# EAGLE design schema_v1_4a (EAGLE 6.2)
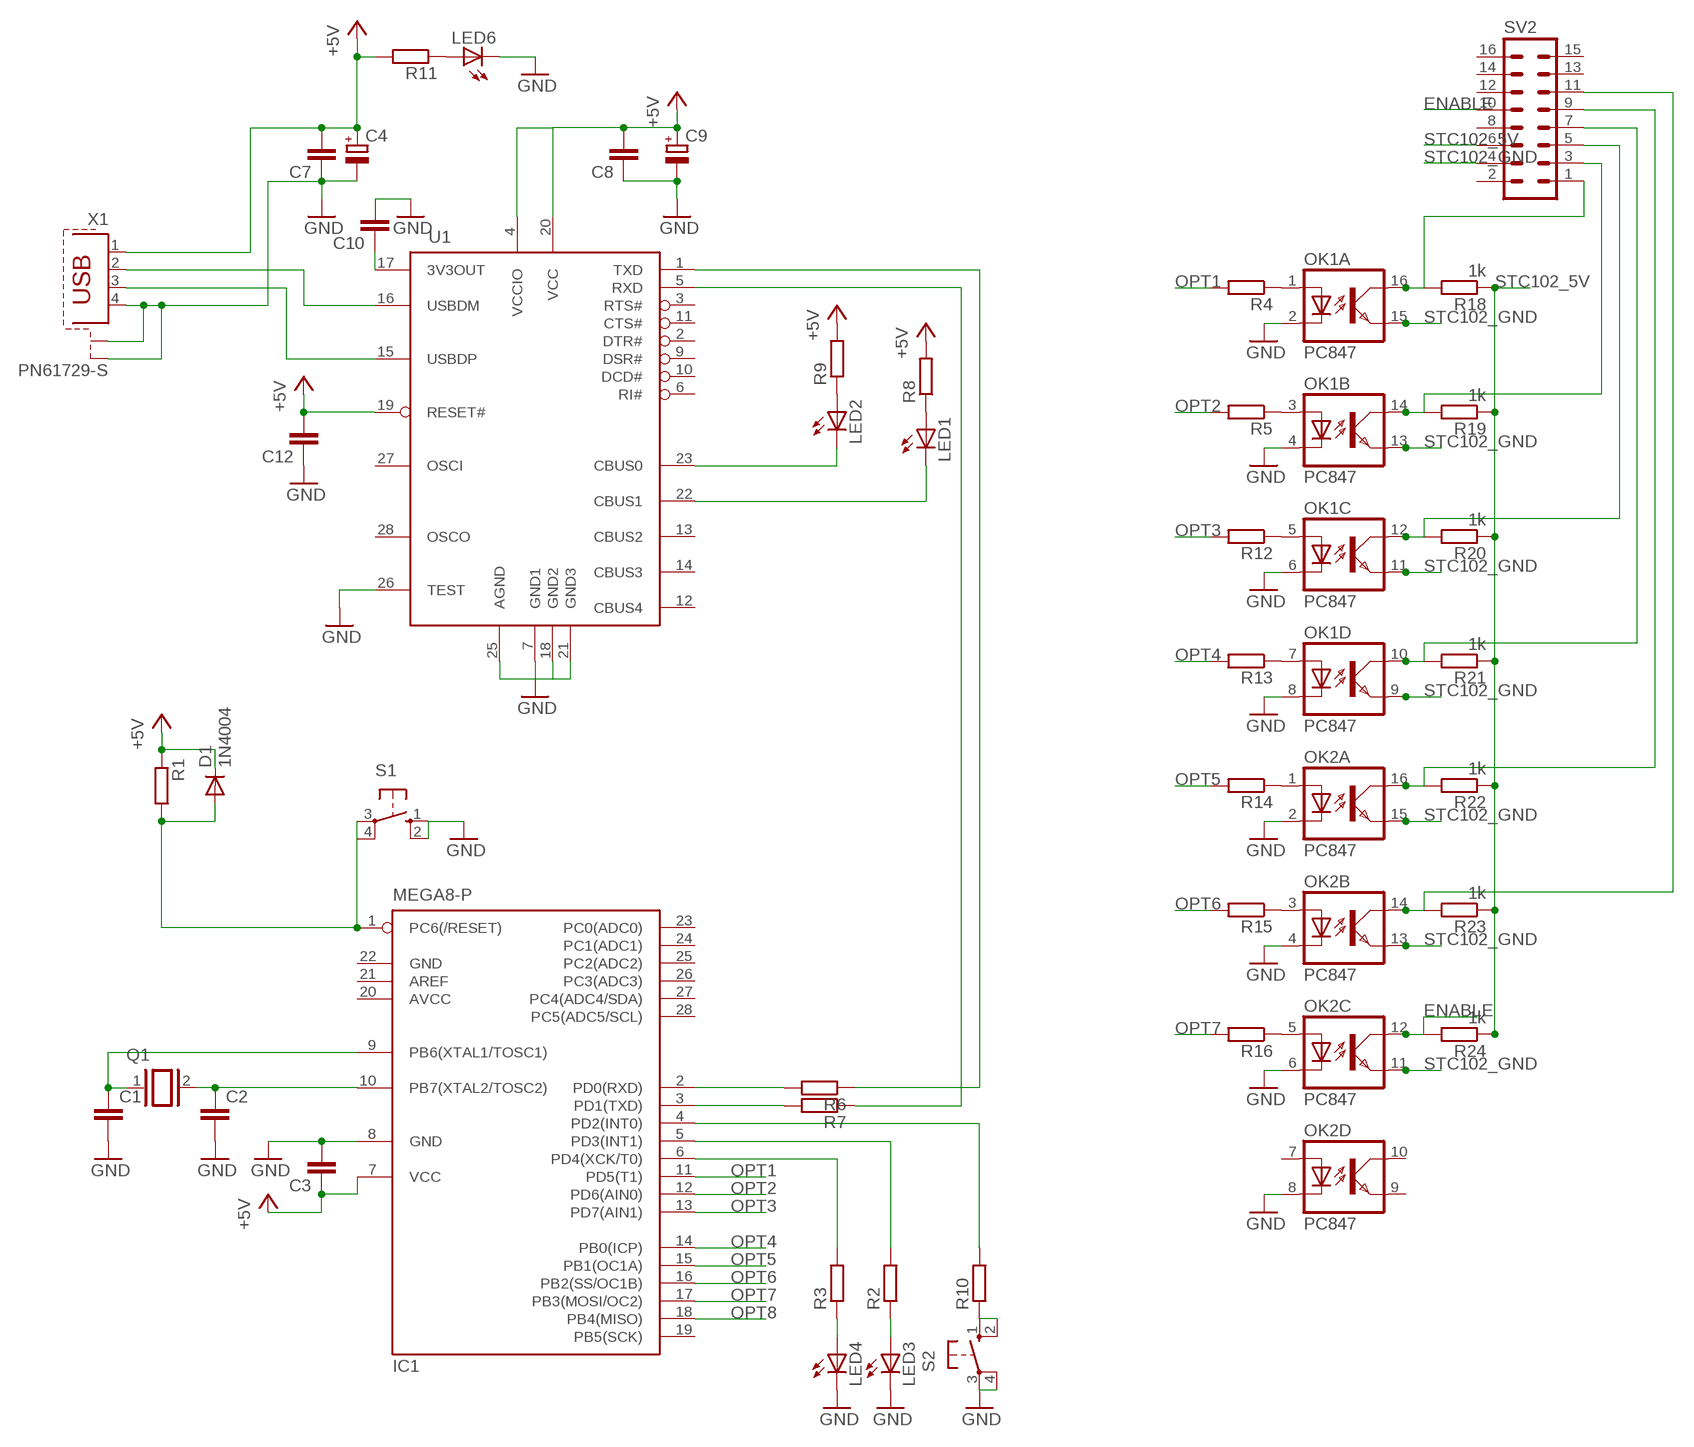
[diagram p0: schematic, sheet 1]

## Parts
C1  C-EUC0805  [C0805]
C2  C-EUC0805  [C0805]
C3  C-EUC0805  [C0805]
C4  CPOL-EUE2.5-5  [E2,5-5]
C7  C-EU025-025X050  [C025-025X050]
C8  C-EU025-025X050  [C025-025X050]
C9  CPOL-EUE2.5-5  [E2,5-5]
C10  C-EU025-025X050  [C025-025X050]
C12  C-EU025-025X050  [C025-025X050]
D1  1N4004  [DO41-10]
IC1  MEGA8-P  [DIL28-3]
LED1  LED3MM  [LED3MM]
LED2  LED3MM  [LED3MM]
LED3  LED3MM  [LED3MM]
LED4  LED3MM  [LED3MM]
LED6  LED3MM  [LED3MM]
OK1  PC847  [DIL16]
OK2  PC847  [DIL16]
Q1  XTAL  [Q]
R1  R-EU_M1206  [M1206]
R2  R-EU_0207/10  [0207/10]
R3  R-EU_0207/10  [0207/10]
R4  R-EU_0207/10  [0207/10]
R5  R-EU_0207/10  [0207/10]
R6  R-EU_M1206  [M1206]
R7  R-EU_M1206  [M1206]
R8  R-EU_M1206  [M1206]
R9  R-EU_M1206  [M1206]
R10  R-EU_0207/10  [0207/10]
R11  R-EU_M1206  [M1206]
R12  R-EU_0207/10  [0207/10]
R13  R-EU_0207/10  [0207/10]
R14  R-EU_0207/10  [0207/10]
R15  R-EU_0207/10  [0207/10]
R16  R-EU_0207/10  [0207/10]
R18  1k  R-EU_0207/10  [0207/10]
R19  1k  R-EU_0207/10  [0207/10]
R20  1k  R-EU_0207/10  [0207/10]
R21  1k  R-EU_0207/10  [0207/10]
R22  1k  R-EU_0207/10  [0207/10]
R23  1k  R-EU_0207/10  [0207/10]
R24  1k  R-EU_0207/10  [0207/10]
S1  10-XX  [B3F-10XX]
S2  10-XX  [B3F-10XX]
SV2  MA08-2  [MA08-2]
U1  FT232RL  [SSOP28DB]
X1  PN61729-S  [PN61729-S]

## Nets
+5V: C3.1 C4.+ C7.2 C8.2 C9.+ C12.2 D1.C IC1.7(VCC) R1.1 R8.2 R9.2 R11.2 U1.4(VCCIO) U1.19(RESET#) U1.20(VCC) X1.1
ENABLE: OK2.12(C:COL) R24.2 SV2.10
GND: C1.2 C2.2 C3.2 C4.- C7.1 C8.1 C9.- C10.2 C12.1 IC1.8(GND) LED3.K(C) LED4.K(C) LED6.K(C) OK1.2(A:C) OK1.4(B:C) OK1.6(C:C) OK1.8(D:C) OK2.2(A:C) OK2.4(B:C) OK2.6(C:C) OK2.8(D:C) S1.1(S) S1.2(S1) S2.3(P) S2.4(P1) U1.7(GND1) U1.18(GND2) U1.21(GND3) U1.25(AGND) U1.26(TEST) X1.4 X1.S1 X1.S2
N$1: C2.1 IC1.10(PB7(XTAL2/TOSC2)) Q1.2
N$2: C1.1 IC1.9(PB6(XTAL1/TOSC1)) Q1.1
N$3: D1.A IC1.1(PC6(/RESET)) R1.2 S1.3(P) S1.4(P1)
N$4: IC1.6(PD4(XCK/T0)) R3.2
N$5: IC1.4(PD2(INT0)) R10.2
N$6: LED3.A R2.1
N$7: LED4.A R3.1
N$8: R10.1 S2.1(S) S2.2(S1)
N$9: OK1.16(A:COL) R18.2 SV2.1
N$10: IC1.5(PD3(INT1)) R2.2
N$11: OK1.14(B:COL) R19.2 SV2.3
N$12: OK1.12(C:COL) R20.2 SV2.5
N$13: OK1.10(D:COL) R21.2 SV2.7
N$14: OK2.16(A:COL) R22.2 SV2.9
N$15: OK2.14(B:COL) R23.2 SV2.11
N$16: LED2.K(C) U1.23(CBUS0)
N$17: LED6.A R11.1
N$18: U1.16(USBDM) X1.2
N$19: U1.15(USBDP) X1.3
N$20: C10.1 U1.17(3V3OUT)
N$21: LED1.A R8.1
N$22: LED2.A R9.1
N$24: LED1.K(C) U1.22(CBUS1)
N$25: R6.1 U1.1(TXD)
N$26: IC1.2(PD0(RXD)) R6.2
N$27: IC1.3(PD1(TXD)) R7.2
N$28: R7.1 U1.5(RXD)
N$29: OK1.1(A:A) R4.1
N$30: OK1.3(B:A) R5.1
N$31: OK1.5(C:A) R12.1
N$32: OK1.7(D:A) R13.1
N$33: OK2.1(A:A) R14.1
N$34: OK2.3(B:A) R15.1
N$35: OK2.5(C:A) R16.1
OPT1: IC1.11(PD5(T1)) R4.2
OPT2: IC1.12(PD6(AIN0)) R5.2
OPT3: IC1.13(PD7(AIN1)) R12.2
OPT4: IC1.14(PB0(ICP)) R13.2
OPT5: IC1.15(PB1(OC1A)) R14.2
OPT6: IC1.16(PB2(SS/OC1B)) R15.2
OPT7: IC1.17(PB3(MOSI/OC2)) R16.2
OPT8: IC1.18(PB4(MISO))
STC102_5V: R18.1 R19.1 R20.1 R21.1 R22.1 R23.1 R24.1 SV2.6
STC102_GND: OK1.9(D:EMIT) OK1.11(C:EMIT) OK1.13(B:EMIT) OK1.15(A:EMIT) OK2.11(C:EMIT) OK2.13(B:EMIT) OK2.15(A:EMIT) SV2.4
Unconnected: IC1.19(PB5(SCK)) IC1.21(AREF) IC1.23(PC0(ADC0)) IC1.24(PC1(ADC1)) IC1.25(PC2(ADC2)) IC1.26(PC3(ADC3)) IC1.27(PC4(ADC4/SDA)) IC1.28(PC5(ADC5/SCL)) OK2.7(D:A) OK2.9(D:EMIT) OK2.10(D:COL) SV2.2 SV2.8 SV2.12 SV2.13 SV2.14 SV2.15 SV2.16 U1.2(DTR#) U1.3(RTS#) U1.6(RI#) U1.9(DSR#) U1.10(DCD#) U1.11(CTS#) U1.12(CBUS4) U1.13(CBUS2) U1.14(CBUS3) U1.27(OSCI) U1.28(OSCO)

## Power pins joined to a net without a drawn wire
AVCC: IC1.20(AVCC)
GND: IC1.22(GND)

## Library data of the parts
C1-C3 C7 C8 C10 C12 = rcl:C-EU: CAPACITOR, European symbol
C4 C9 = rcl:CPOL-EU: POLARIZED CAPACITOR, European symbol
D1 = diode:1N4004: DIODE general purpose rectifier, 1 A
IC1 = atmel:MEGA8-P: MICROCONTROLLER 8 Kbytes FLASH, 1 kbytes SRAM, 512 bytes EEPROM, USART, 4-channel 10 bit ADC, 2-channel 8 bit ADC Pin compatible with Atmega48, ATMega88, ATMega168 Source: avr.lbr; OC_FARNELL: unknown; OC_NEWARK: unknown
LED1-LED4 LED6 = led:LED: LED OSRAM: - CHIPLED LG R971, LG N971, LY N971, LG Q971, LY Q971, LO R971, LY R971 LH N974, LH R974 LS Q976, LO Q976, LY Q976 LO Q996 - Hyper CHIPLED LW Q18S LB Q993, LB Q99A, LB R99A - SideLED LS A670, LO A670, LY A670, LG A670, LP A670 LB A673, LV A673, LT A673, LW A673 LH A674 LY A675 LS A676, LA A676, LO A676, LY A676, LW A676 LS A679, LY A679, LG A679 - Hyper Micro SIDELED® LS Y876, LA Y876, LO Y876, LY Y876 LT Y87S - SmartLED LW L88C, LW L88S LB L89C, LB L89S, LG L890 LS L89K, LO L89K, LY L89K LS L896, LA L896, LO L896, LY L896 - TOPLED LS T670, LO T670, LY T670, LG T670, LP T670 LSG T670, LSP T670, LSY T670, LOP T670, LYG T670 LG T671, LOG T671, LSG T671 LB T673, LV T673, LT T673, LW T673 LH T674 LS T676, LA T676, LO T676, LY T676, LB T676, LH T676, LSB T676, LW T676 LB T67C, LV T67C, LT T67C, LS T67K, LO T67K, LY T67K, LW E67C LS E67B, LA E67B, LO E67B, LY E67B, LB E67C, LV E67C, LT E67C LW T67C LS T679, LY T679, LG T679 LS T770, LO T770, LY T770, LG T770, LP T770 LB T773, LV T773, LT T773, LW T773 LH T774 LS E675, LA E675, LY E675, LS T675 LS T776, LA T776, LO T776, LY T776, LB T776 LHGB T686 LT T68C, LB T68C - Hyper Mini TOPLED® LB M676 - Mini TOPLED Santana® LG M470 LS M47K, LO M47K, LY M47K Source: http://www.osram.convergy.de LUXEON: - LUMILED® LXK2-PW12-R00, LXK2-PW12-S00, LXK2-PW14-U00, LXK2-PW14-V00 LXK2-PM12-R00, LXK2-PM12-S00, LXK2-PM14-U00 LXK2-PE12-Q00, LXK2-PE12-R00, LXK2-PE12-S00, LXK2-PE14-T00, LXK2-PE14-U00 LXK2-PB12-K00, LXK2-PB12-L00, LXK2-PB12-M00, LXK2-PB14-N00, LXK2-PB14-P00, LXK2-PB14-Q00 LXK2-PR12-L00, LXK2-PR12-M00, LXK2-PR14-Q00, LXK2-PR14-R00 LXK2-PD12-Q00, LXK2-PD12-R00, LXK2-PD12-S00 LXK2-PH12-R00, LXK2-PH12-S00 LXK2-PL12-P00, LXK2-PL12-Q00, LXK2-PL12-R00 Source: www.luxeon.com KINGBRIGHT: KA-3528ASYC Source: www.kingbright.com
OK1 OK2 = optocoupler:PC847: SHARP OPTO COUPLER; OC_FARNELL: 9707735; OC_NEWARK: unknown
Q1 = special:XTAL: CRYSTAL
R1-R16 R18-R24 = rcl:R-EU_: RESISTOR, European symbol
S1 S2 = switch-omron:10-XX: OMRON SWITCH; MPN: B3F-1000; OC_FARNELL: 176432; OC_NEWARK: 36M3542
SV2 = con-lstb:MA08-2: PIN HEADER; OC_FARNELL: unknown; OC_NEWARK: unknown
U1 = ftdichip-5:FT232RL: USB UART 4th Generation USB UART (USB <-> Serial) Controller
X1 = con-berg:PN61729-S: BERG USB connector; OC_FARNELL: unknown; OC_NEWARK: unknown

## Board
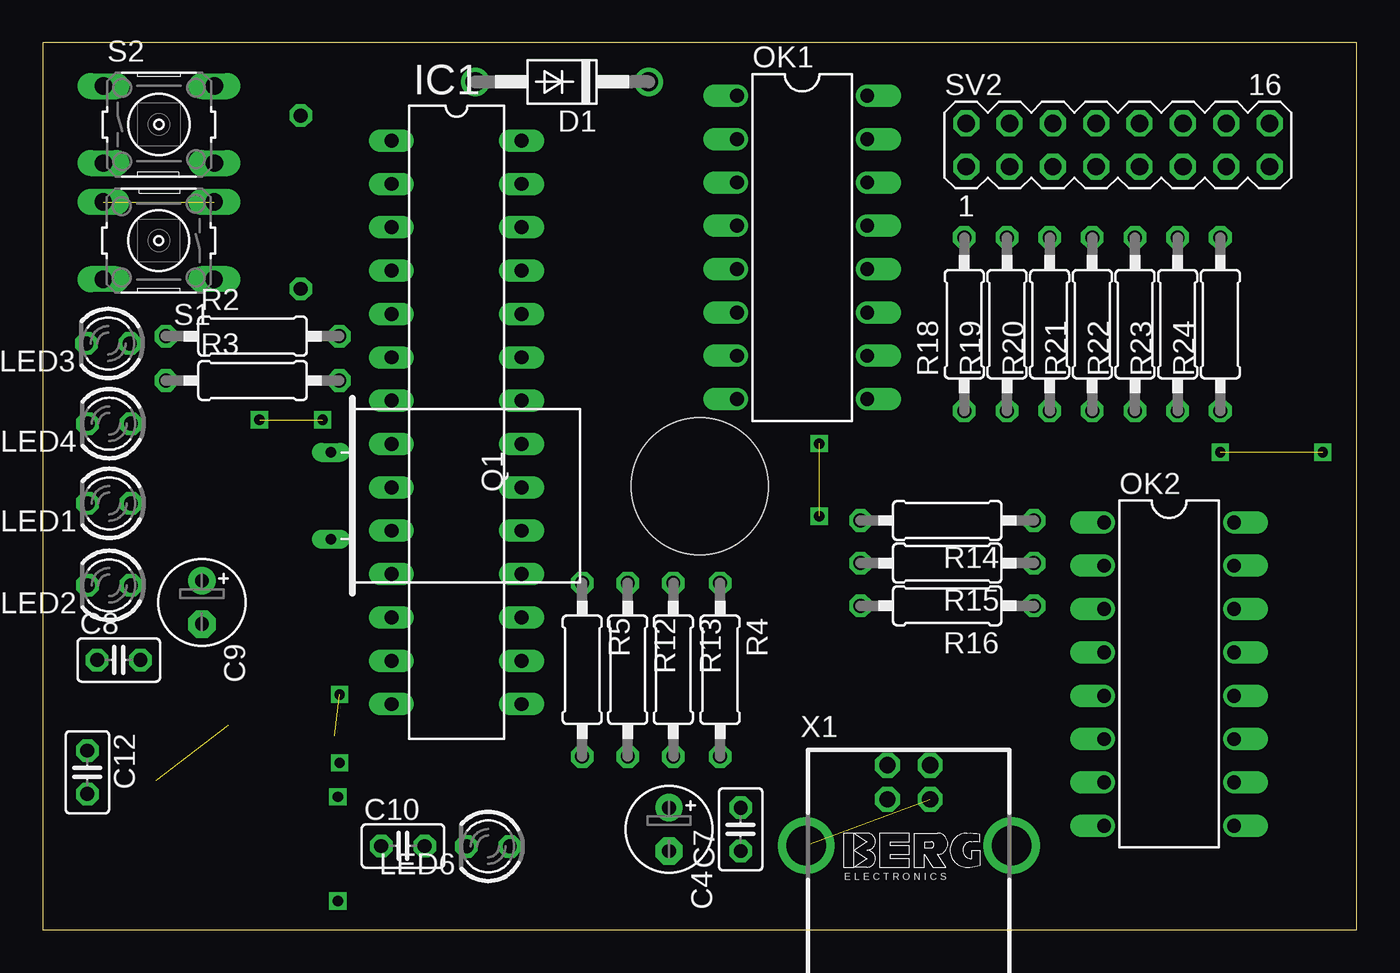
[diagram p1: board, top side]
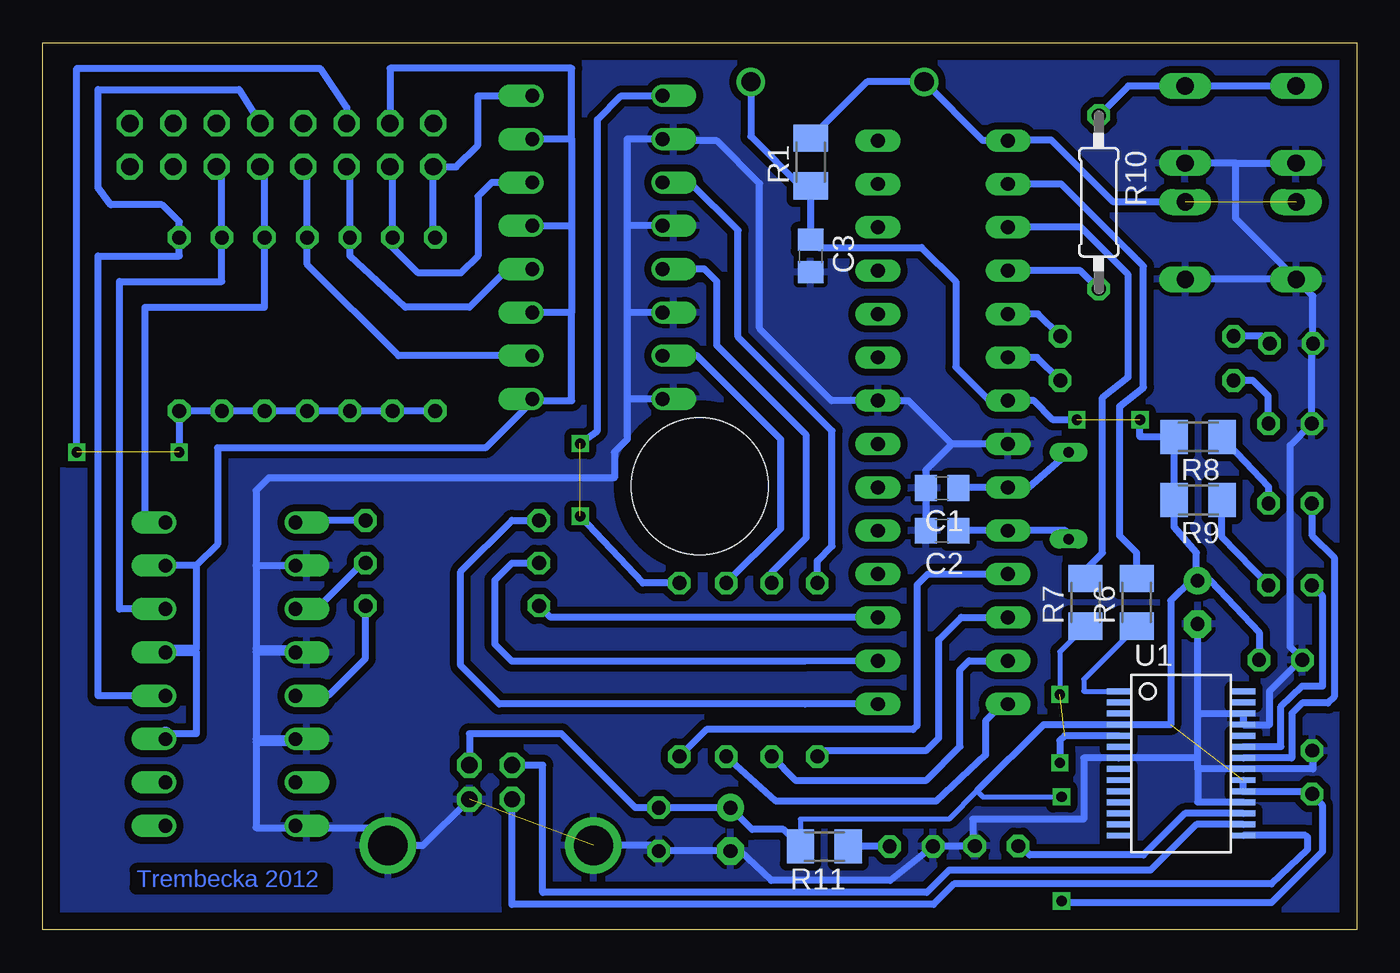
[diagram p2: board, bottom side, seen from below]

Size 77 x 52 mm. Coordinates in mm from the lower left corner, seen from the top.
Outline: 0,0 77,0 77,52 0,52 0,0
Copper layers (1*16): Top 0.035mm / dielectric 1.5mm / Bottom 0.035mm
Design rules: minimum track width 10mil, minimum drill 24mil, track to track 8mil, track to pad 8mil, pad to pad 8mil, via to via 8mil, smd to smd 8mil, copper to edge 40mil, drill to drill 8mil, minimum pad ring 10mil, minimum via ring 8mil, stop-mask expansion 4mil, vias tented up to drill 0mil, thermal gap 10mil
Holes 8 mm at 38.5,26

### Footprints (pad centres in the part's own frame; a part is rotated, then mirrored left to right if it is on the bottom)
C0805 = smd 1.3 x 1.5: 1 -0.95,0; 2 0.95,0
E2,5-5 = drill 0.813 pad 1.6: + -1.27,0 | drill 0.813 pad 1.6 octagon: - 1.27,0
C025-025X050 = drill 0.813 octagon: 1 -1.27,0; 2 1.27,0
DO41-10 = drill 1.118: A 5.08,0; C -5.08,0
DIL28-3 = drill 0.813 long: 1 -16.51,-3.81; 2 -13.97,-3.81; 3 -11.43,-3.81; 4 -8.89,-3.81; 5 -6.35,-3.81; 6 -3.81,-3.81; 7 -1.27,-3.81; 8 1.27,-3.81; 9 3.81,-3.81; 10 6.35,-3.81; 11 8.89,-3.81; 12 11.43,-3.81; 13 13.97,-3.81; 14 16.51,-3.81; 15 16.51,3.81; 16 13.97,3.81; 17 11.43,3.81; 18 8.89,3.81; 19 6.35,3.81; 20 3.81,3.81; 21 1.27,3.81; 22 -1.27,3.81; 23 -3.81,3.81; 24 -6.35,3.81; 25 -8.89,3.81; 26 -11.43,3.81; 27 -13.97,3.81; 28 -16.51,3.81
LED3MM = drill 0.813 octagon: A -1.27,0; K 1.27,0
DIL16 = drill 0.813 offset: 1 -8.89,-3.81; 2 -6.35,-3.81; 3 -3.81,-3.81; 4 -1.27,-3.81; 5 1.27,-3.81; 6 3.81,-3.81; 7 6.35,-3.81; 8 8.89,-3.81; 9 8.89,3.81; 10 6.35,3.81; 11 3.81,3.81; 12 1.27,3.81; 13 -1.27,3.81; 14 -3.81,3.81; 15 -6.35,3.81; 16 -8.89,3.81
Q = drill 0.61 long: 1 -2.54,-7.62; 2 2.54,-7.62
M1206 = smd 1.6 x 2: 1 -1.4,0; 2 1.4,0
0207/10 = drill 0.813 octagon: 1 -5.08,0; 2 5.08,0
B3F-10XX = drill 1.016 long: 1 -3.251,2.261; 2 3.251,2.261; 3 -3.251,-2.261; 4 3.251,-2.261
MA08-2 = drill 1.016 octagon: 1 -8.89,-1.27; 2 -8.89,1.27; 3 -6.35,-1.27; 4 -6.35,1.27; 5 -3.81,-1.27; 6 -3.81,1.27; 7 -1.27,-1.27; 8 -1.27,1.27; 9 1.27,-1.27; 10 1.27,1.27; 11 3.81,-1.27; 12 3.81,1.27; 13 6.35,-1.27; 14 6.35,1.27; 15 8.89,-1.27; 16 8.89,1.27
SSOP28DB = smd 0.348 x 1.397: 1 -4.225,-3.656; 2 -3.575,-3.656; 3 -2.925,-3.656; 4 -2.275,-3.656; 5 -1.625,-3.656; 6 -0.975,-3.656; 7 -0.325,-3.656; 8 0.325,-3.656; 9 0.975,-3.656; 10 1.625,-3.656; 11 2.275,-3.656; 12 2.925,-3.656; 13 3.575,-3.656; 14 4.225,-3.656; 15 4.225,3.656; 16 3.575,3.656; 17 2.925,3.656; 18 2.275,3.656; 19 1.625,3.656; 20 0.975,3.656; 21 0.325,3.656; 22 -0.325,3.656; 23 -0.975,3.656; 24 -1.625,3.656; 25 -2.275,3.656; 26 -2.925,3.656; 27 -3.575,3.656; 28 -4.225,3.656
PN61729-S = drill 0.95 octagon: 1 1.25,4.71; 2 -1.25,4.71; 3 -1.25,2.71; 4 1.25,2.71 | drill 2.3 pad 2.9: S1 -6.02,0; S2 6.02,0

### Placement (x,y rotation side)
C1  24.3,25.9 180 bottom
C2  24.3,23.4 180 bottom
C3  32,39.5 270 bottom
C4  36.7,5.9 270 top
C7  40.9,5.9 90 top
C8  4.46,15.82 0 top
C9  9.33,19.2 270 top
C10  21.11,4.92 0 top
C12  2.62,9.24 270 top
D1  30.43,49.7 180 top
IC1  24.25,29.75 270 top
LED1  3.9,25 180 top
LED2  3.9,20.2 180 top
LED3  3.84,34.37 180 top
LED4  3.9,29.67 180 top
LED6  26.1,4.9 180 top
OK1  44.5,40 270 top
OK2  66,15 270 top
Q1  24.5,25.45 270 top
R1  32,45 90 bottom
R2  12.3,34.8 0 top
R3  12.3,32.2 0 top
R4  39.69,15.25 270 top
R5  31.61,15.25 270 top
R6  12.9,19.2 90 bottom
R7  15.9,19.2 90 bottom
R8  9.3,28.9 180 bottom
R9  9.3,25.2 180 bottom
R10  15.12,42.65 270 bottom
R11  31.2,4.9 180 bottom
R12  34.28,15.25 270 top
R13  36.95,15.25 270 top
R14  53,24 180 top
R15  53,21.5 180 top
R16  53,19 180 top
R18  54,35.5 90 top
R19  56.5,35.5 90 top
R20  59,35.5 90 top
R21  61.5,35.5 90 top
R22  64,35.5 90 top
R23  66.5,35.5 90 top
R24  69,35.5 90 top
S1  6.8,40.4 180 top
S2  6.82,47.2 0 top
SV2  63,46 0 top
U1  10.3,9.76 270 bottom
X1  50.75,4.95 0 top

### Tracks (layer width: path | path; a pad name or v marks a point on that pad's centre or on a via)
+5V  (via drill 0.6)  (2 unrouted)
  Bottom 0.305: R11.2 32.6,6.5 23.9,6.5 22.25,8.15 21.9,7.8 17.3,7.8 | U1.20 U1.19 2.79,8.13 C12.2 | 6.7,8.1 6.64,8.16
  Bottom 0.406: R11.2 33.6,5.9 35.43,5.9 C4.+ C7.2 42.27,7.17 46.6,11.5 52,11.5 X1.1 | 22.25,8.15 18.36,12.04 U1.4 10.9,12.04 10.9,19.3 9.73,20.47 C9.+ 8.57,20.47 5.7,17.4 5.7,15.85 | 9.4,20.54 9.4,22.1 10.7,23.6 R9.2 R8.2 12.7,28.9 v12.7,29.9 | v16.4,29.9 17.8,29.9 18.92,31.02 IC1.7 21.52,31.02 23.5,33 23.5,38 25.5,40 31.55,40 C3.1 R1.1 32.1,43.5 32.5,43.5 35.51,46.51 D1.C | 6.64,8.16 U1.20 | 6.7,8.1 2.8,8.1 2,7.3 2,4.6 5,1.6 17.2,1.6
  Bottom 0.813: C9.+ 9.4,20.54 | C8.2 5.7,15.85
ENABLE
  Bottom 0.406: SV2.10 65.5,49.25 73.75,49.25 73.75,43.5 73,42.5 70,42.5 69,41.5 R24.2 69,39.5 73.75,39.5 73.75,13.73 OK2.12
GND  (1 unrouted)
  Bottom 0.305: 6.64,7.5 U1.18 | 3.28,15.82 C8.1 3.19,15.89 | 9.33,10 9.41,10.09
  Bottom 0.406: 64.5,21.35 OK2.2 | 64.5,21.35 64.5,16.5 62.19,16.5 | OK2.4 64.5,16.27 64.5,11 62.19,11 | OK2.6 64.5,11.19 64.5,6 62.19,6 57.82,6 X1.S2 54.71,4.95 X1.4 | OK1.2 42.75,46.35 42.75,41.27 | 42.75,36.19 42.75,31.11 | 42.75,31.11 42.75,28.75 43.5,28 43.5,26.5 63.75,26.5 64.5,25.75 64.5,21.35 | 40.59,46.25 37.5,46.25 35,43.75 35,35.25 30.77,31.02 IC1.22 26.26,31.02 23.72,28.48 | S1.2 S1.1 | 7.1,44.94 S2.3 | 2.63,34.31 LED4.K 3.9,28.4 3.9,16.6 3.19,15.89 | X1.S1 41.22,4.95 C7.1 C4.- 36.13,4.63 34.3,2.9 27.33,2.9 LED6.K 22.64,4.9 22.5,5.04 | C12.1 2.58,9.44 U1.21 9.33,9.44 | 9.33,12.69 U1.26 U1.25 5.1,12.04 5.1,14 3.28,15.82 | 9.33,12.69 C9.- | 9.33,9.44 9.33,10 9.33,12.69 | 9.41,10.09 U1.7 16,10.09 16,6.5 22.5,6.5 22.5,5.04 | 6.64,7.5 9.33,7.5 9.33,9.44 | IC1.8 23.72,28.48 | C2.2 C1.2 25.25,26.95 23.72,28.48 | LED3.K 2.57,37.16 S1.2 | S1.2 7.1,41.69 7.1,44.94 | 7.1,44.94 S2.4 | 22.5,5.04 C10.2 | OK1.6 42.75,36.19 | OK1.4 42.75,41.27 | 42.75,41.27 42.75,36.19 | OK1.8 42.75,31.11
  Bottom 0.61: 40.59,46.25 OK1.2
  Bottom 0.813: 62.19,16.5 OK2.4 | 62.19,11 OK2.6 | 62.19,6 OK2.8 | 2.63,34.31 LED3.K
  pour Bottom (isolate 0.406): 0,52 77,52 77,0 0,0
N$1
  Bottom 0.406: Q1.2 17.07,23.4 IC1.10 C2.1
N$2
  Bottom 0.406: Q1.1 19.23,25.94 IC1.9 23.31,25.94
  Bottom 0.813: 23.31,25.94 arc-90 C1.1
N$3  (1 unrouted)
  Bottom 0.406: IC1.1 21.91,46.26 D1.A 28.7,49.7 R1.2 | S1.3 14.26,42.66 17.9,46.3 20.4,46.3
  Bottom 1.016: 20.4,46.3 IC1.1
N$4
  Bottom 0.406: IC1.6 18.74,33.56 R3.2
N$5
  Bottom 0.406: R10.2 16.19,38.64 IC1.4
N$6
  Bottom 0.406: R2.1 5.54,34.8 LED3.A
N$7
  Bottom 0.406: R3.1 6.1,32.2 5.2,31.3 5.2,29.7
  Bottom 0.813: LED4.A 5.2,29.7
N$8
  Bottom 0.406: S2.1 S2.2 13.39,49.46 R10.1
N$9
  Bottom 0.406: R18.2 54.11,40.58 SV2.1 | SV2.1 53.84,45 | OK1.16 51.5,48.89 51.5,46 52.77,44.73 SV2.1
N$10
  Bottom 0.406: IC1.5 18.68,36.1 R2.2
N$11
  Bottom 0.406: SV2.3 56.5,44.58 R19.2 56.5,40 55,38.5 52.5,38.5 51.5,39.5 51.5,43 50.69,43.81 OK1.14
N$12
  Bottom 0.406: SV2.5 59,44.54 R20.2 59,39.5 55.75,36.5 52,36.5 49.77,38.73 OK1.12
N$13
  Bottom 0.406: SV2.7 61.5,44.5 R21.2 61.5,39 56.15,33.65 OK1.10
N$14
  Bottom 0.406: SV2.9 64,44.46 R22.2 64,36.5 71,36.5 71,23.89
  Bottom 0.813: OK2.16 71,23.89
N$15
  Bottom 0.406: SV2.11 66.5,44.42 R23.2 66.5,38 72.5,38 72.5,18.81 OK2.14
N$16
  Bottom 0.406: U1.23 4.45,10.73 4.45,13.1 3.2,14.3 2,14.3 2,19.57 LED2.K
N$17
  Bottom 0.406: LED6.A R11.1
N$18
  Bottom 0.406: X1.2 47.7,9.66 47.7,2.2 25.2,2.2 23.9,3.5 12.09,3.5 9.4,6.18 U1.16
N$19
  Bottom 0.305: 2.9,5.54 3,5.54 2.9,5.43
  Bottom 0.406: X1.3 49.5,1.5 24.8,1.5 23.6,2.7 5,2.7 2.9,4.7 2.9,5.43 | 3,5.54 U1.15
N$20
  Bottom 0.406: C10.1 19.16,4.4 12.5,4.4 10.06,6.83 U1.17
N$21
  Bottom 0.406: R8.1 5.17,25.97 LED1.A
N$22
  Bottom 0.406: R9.1 7.9,23.03 LED2.A
N$23  (via drill 0.6)
  other vias: 17.3,1.7
N$24
  Bottom 0.305: 3.8,10.1 3.81,10.09 | 2.6,24.97 LED1.K
  Bottom 0.406: 3.81,10.09 U1.22 | 3.8,10.1 3.8,12.7 3.2,13.3 1.7,13.3 1.3,13.7 1.3,21.8 2.6,23.1 2.6,24.97
N$25
  Bottom 0.305: R6.1 16,14.7 16,13.98 U1.1
N$26
  Bottom 0.406: IC1.2 17.32,43.72 12.5,38.9 12.5,31.8 13.9,30.7 13.9,23.1 12.9,22.1 R6.2
N$27
  Bottom 0.406: IC1.3 16.18,41.18 13.4,38.4 13.4,32.4 14.9,31.2 14.9,22.1 15.9,21.1 R7.2
N$28  (via drill 0.6)  (1 unrouted)
  Bottom 0.305: R7.1 17.4,16.3 v17.4,13.8
  Bottom 0.406: U1.5 17.11,11.38 17.4,11.1 v17.4,9.8
N$29  (via drill 0.6)  (1 unrouted)
  Bottom 0.406: R4.1 41.83,20.33 v45.5,24.25 | v45.5,28.5 44.5,29.25 44.5,47.5 43.11,48.89 OK1.1
N$30
  Bottom 0.406: R5.1 31.61,21.64 30.75,22.5 30.75,29.25 36.25,34.75 36.25,41 39.06,43.81
  Bottom 0.61: 39.06,43.81 OK1.3
N$31
  Bottom 0.406: R12.1 34.28,20.97 32.25,23 32.25,29 37.5,34.25 37.5,38 38.23,38.73 OK1.5
N$32
  Bottom 0.406: OK1.7 38.65,33.65 33.75,28.75 33.75,23.53 R13.1
N$33
  Bottom 0.406: R14.1 62.08,24
  Bottom 0.813: 62.08,24 OK2.1
N$34
  Bottom 0.406: 58.25,21.5 61,18.75 62.13,18.75
  Bottom 0.813: 58.25,21.5 R15.1 | 62.13,18.75 OK2.3
N$35
  Bottom 0.406: R16.1 58.08,15.92 60.25,13.75 62.17,13.75
  Bottom 0.813: 62.17,13.75 OK2.5
N$36  (via drill 0.6)
  other vias: 17.3,7.8
OPT1
  Bottom 0.406: R4.2 38.11,11.75 26,11.75 25.75,12 25.75,20.25 25.14,20.86 IC1.11
OPT2
  Bottom 0.406: R5.2 31.28,10.5 25.25,10.5 24.5,11.25 24.5,17 23.18,18.32 IC1.12
OPT3
  Bottom 0.406: R12.2 32.86,8.75 25.25,8.75 23.25,10.75 23.25,15.25 22.72,15.78 IC1.13
OPT4
  Bottom 0.406: R13.2 34.03,7.55 24.65,7.55 21.75,10.25 21.75,12.25 20.76,13.24 IC1.14
OPT5
  Bottom 0.406: R14.2 49.5,24 52.5,21 52.5,15.5 50.25,13.25 32.32,13.25 IC1.15
OPT6
  Bottom 0.406: R15.2 49.5,21.5 50.5,20.5 50.5,16.75 49.5,15.75 32.34,15.75 IC1.16
OPT7
  Bottom 0.406: R16.2 47.24,18.32 IC1.17
STC102_5V  (via drill 0.6)  (1 unrouted)
  Bottom 0.406: R18.1 R19.1 R20.1 R21.1 R22.1 R23.1 R24.1 v69,28 | SV2.6 59.19,48.19 60.75,50.5 75,50.5 v75,28
STC102_GND
  Bottom 0.406: 68,21.35 OK2.15 | 68,21.35 68,16.5 69.81,16.5 | OK2.13 68,16.27 68,11.5 69.81,11.5 | 46,46.35 OK1.15 | 46,36.19 OK1.11 | 46,36.19 46,31 48.31,31 | SV2.4 56.65,50.5 46,50.5 46,46.35 | 68,21.35 66.75,22.6 66.75,28.25 51.06,28.25 48.31,31 | 46,46.35 46,41.27 | 46,41.27 46,36.19 | OK1.13 46,41.27 | 48.31,31 OK1.9
  Bottom 0.813: 69.81,16.5 OK2.13 | 69.81,11.5 OK2.11

### Text on the board
Bottom: Trembecka 2012